# Altium schematic sheet 89c51.SchDoc
size A4
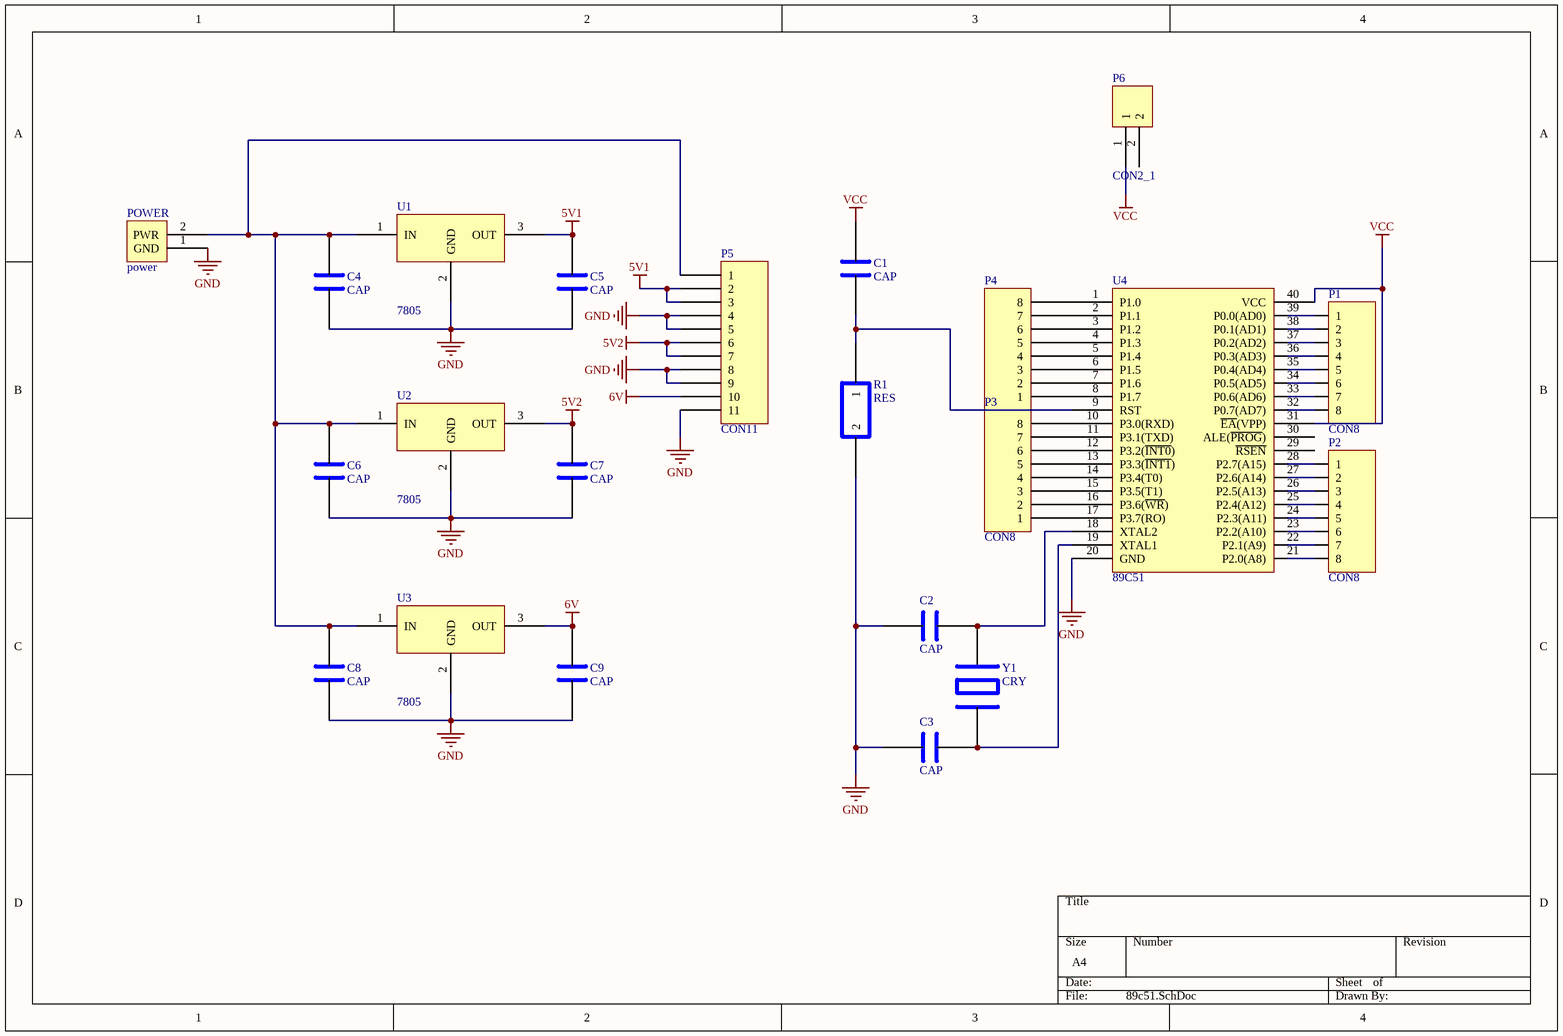
[diagram p0: 89c51.SchDoc]

## Parts
C1  CAP
C2  CAP
C3  CAP
C4  CAP
C5  CAP
C6  CAP
C7  CAP
C8  CAP
C9  CAP
P1  CON8
P2  CON8
P3  CON8
P4  CON8
P5  CON11
P6  CON2_1  [HDR1X2]
POWER  power
R1  RES
U1  7805
U2  7805
U3  7805
U4  89C51
Y1  CRY

## Nets
5V1: C5.1(IN) P5.2 P5.3 U1.3(OUT)
5V2: C7.1(IN) P5.6 P5.7 U2.3(OUT)
6V: C9.1(IN) P5.10 U3.3(OUT)
GND: C2.1(IN) C3.1(IN) C4.2(IN) C5.2(IN) C6.2(IN) C7.2(IN) C8.2(IN) C9.2(IN) P5.4 P5.5 P5.8 P5.9 P5.11 POWER.1(GND) R1.2 U1.2(GND) U2.2(GND) U3.2(GND) U4.20(GND)
VCC: C1.1(IN) P6.1 U4.31(~{EA}(VPP)) U4.40(VCC)
NetC1_2: C1.2(IN) R1.1 U4.9(RST)
NetC2_2: C2.2(IN) U4.18(XTAL2) Y1.1
NetC3_2: C3.2(IN) U4.19(XTAL1) Y1.2
NetC4_1: C4.1(IN) C6.1(IN) C8.1(IN) P5.1 POWER.2(PWR) U1.1(IN) U2.1(IN) U3.1(IN)
NetP1_1: P1.1 U4.39(P0.0(AD0))
NetP1_2: P1.2 U4.38(P0.1(AD1))
NetP1_3: P1.3 U4.37(P0.2(AD2))
NetP1_4: P1.4 U4.36(P0.3(AD3))
NetP1_5: P1.5 U4.35(P0.4(AD4))
NetP1_6: P1.6 U4.34(P0.5(AD5))
NetP1_7: P1.7 U4.33(P0.6(AD6))
NetP1_8: P1.8 U4.32(P0.7(AD7))
NetP2_1: P2.1 U4.28(P2.7(A15))
NetP2_2: P2.2 U4.27(P2.6(A14))
NetP2_3: P2.3 U4.26(P2.5(A13))
NetP2_4: P2.4 U4.25(P2.4(A12))
NetP2_5: P2.5 U4.24(P2.3(A11))
NetP2_6: P2.6 U4.23(P2.2(A10))
NetP2_7: P2.7 U4.22(P2.1(A9))
NetP2_8: P2.8 U4.21(P2.0(A8))
NetP3_1: P3.1 U4.17(P3.7(RO))
NetP3_2: P3.2 U4.16(P3.6(~{WR}))
NetP3_3: P3.3 U4.15(P3.5(T1))
NetP3_4: P3.4 U4.14(P3.4(T0))
NetP3_5: P3.5 U4.13(P3.3(~{INT1}))
NetP3_6: P3.6 U4.12(P3.2(~{INT0}))
NetP3_7: P3.7 U4.11(P3.1(TXD))
NetP3_8: P3.8 U4.10(P3.0(RXD))
NetP4_1: P4.1 U4.8(P1.7)
NetP4_2: P4.2 U4.7(P1.6)
NetP4_3: P4.3 U4.6(P1.5)
NetP4_4: P4.4 U4.5(P1.4)
NetP4_5: P4.5 U4.4(P1.3)
NetP4_6: P4.6 U4.3(P1.2)
NetP4_7: P4.7 U4.2(P1.1)
NetP4_8: P4.8 U4.1(P1.0)

Not connected (* = marked no-connect by the designer): P6 2; U4 29(~{RSEN}) 30(ALE(~{PROG}))

## Library data of the parts
P5 = COM11
P6 = COM2_1
POWER = CON2